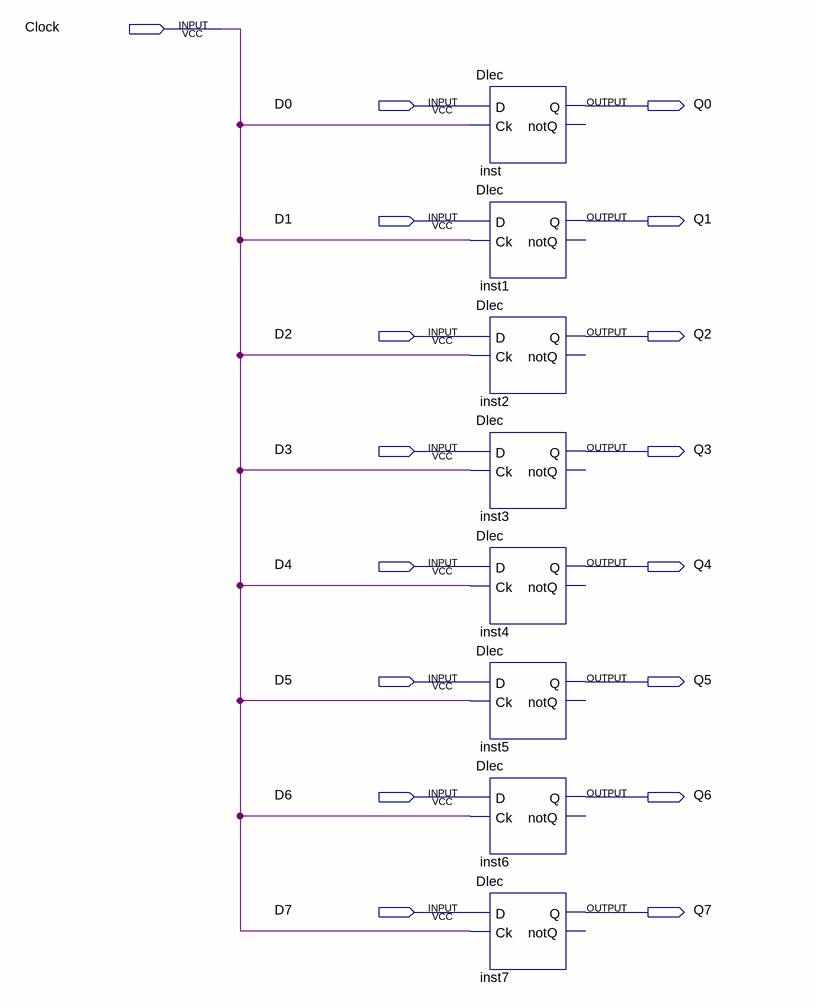
[diagram p0: schematic sheet]
// Quartus schematic Dprihvatni_reg.bdf as structural Verilog: 8 symbols, 17 pins
module Dprihvatni_reg (
  input  Clock,
  input  D0,
  input  D1,
  input  D2,
  input  D3,
  input  D4,
  input  D5,
  input  D6,
  input  D7,
  output Q0,
  output Q1,
  output Q2,
  output Q3,
  output Q4,
  output Q5,
  output Q6,
  output Q7
);

  Dlec inst (.D(D0), .Ck(Clock), .Q(Q0));  // open: notQ
  Dlec inst1 (.D(D1), .Ck(Clock), .Q(Q1));  // open: notQ
  Dlec inst2 (.D(D2), .Ck(Clock), .Q(Q2));  // open: notQ
  Dlec inst3 (.D(D3), .Ck(Clock), .Q(Q3));  // open: notQ
  Dlec inst4 (.D(D4), .Ck(Clock), .Q(Q4));  // open: notQ
  Dlec inst5 (.D(D5), .Ck(Clock), .Q(Q5));  // open: notQ
  Dlec inst6 (.D(D6), .Ck(Clock), .Q(Q6));  // open: notQ
  Dlec inst7 (.D(D7), .Ck(Clock), .Q(Q7));  // open: notQ
endmodule
